# Altium schematic sheet Arduino_extension_connectors.SchDoc: Arduino & Morpho extension connectors
size A4; Date: Not used; ApprovedBy: Not used; CheckedBy: Not used; Author: Not used; CompanyName: STMicroelectronics; DrawnBy: Not used; Engineer: Not used; Organization: Not used; Address1: Not used; Address2: Not used; Address3: Not used; Address4: Not used; DocumentNumber: 6; Revision: Not used; SheetNumber: 6; SheetTotal: 8; CurrentTime: Not used; CurrentDate: Not used; Time: Not used; DocumentFullPathAndName: Not used; DocumentName: Not used; ModifiedDate: Not used; ImagePath: Not used; ProjectName: Not used; Application_BuildNumber: Not used
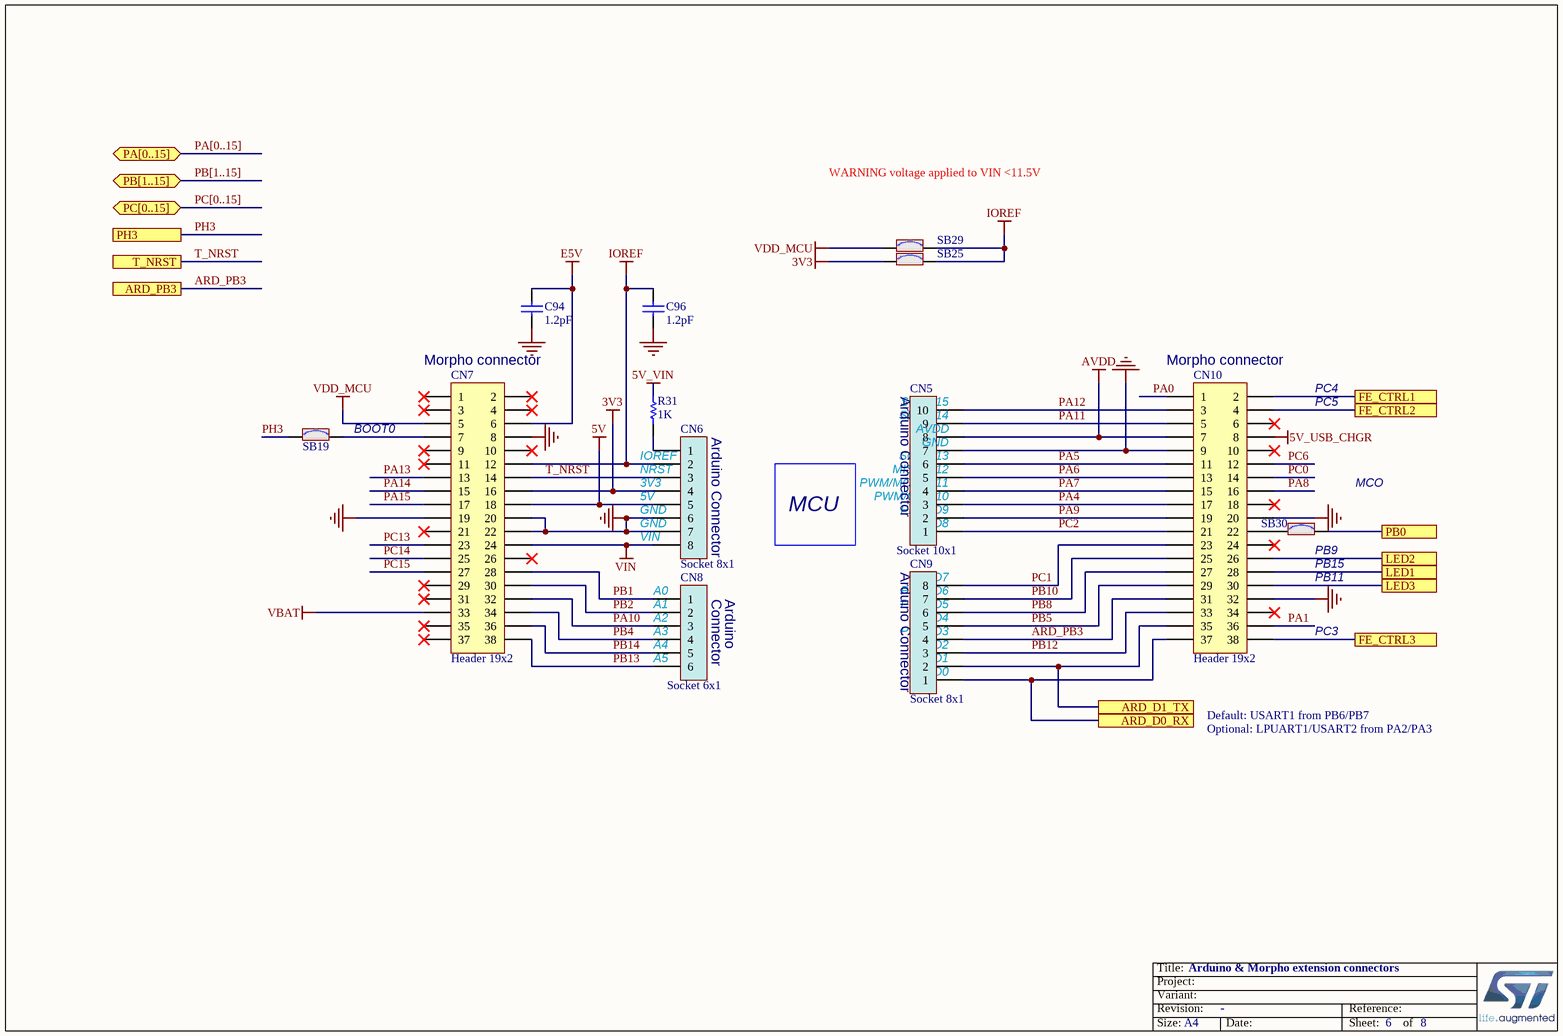
[diagram p0: Arduino_extension_connectors.SchDoc]

## Parts
C94  value 1.2pF  [C0402]  (hidden comment: Capacitor)
C96  value 1.2pF  [C0402]  (hidden comment: Capacitor)
CN5  value Socket 10x1  [CON_SAMTEC_SSW-110-03-X-S]
CN6  value Socket 8x1  [CON_SAMTEC_SSW-108-03-X-S]
CN7  value Header 19x2  [CON_SAMTEC_TSW-119-09-X-D]
CN8  value Socket 6x1  [CON_SAMTEC_SSW-106-03-X-S]
CN9  value Socket 8x1  [CON_SAMTEC_SSW-108-03-X-S]
CN10  value Header 19x2  [CON_SAMTEC_TSW-119-09-X-D]
R31  value 1K  [R0603]
SB19  (no value)  [SOLDER-BRIDGE_R0603-0R]
SB25  (no value)  [SOLDER-BRIDGE_R0603-0R]
SB29  (no value)  [SOLDER-BRIDGE_R0603-0R]
SB30  (no value)  [SOLDER-BRIDGE_R0603-0R]

## Ports
ARD_D0_RX, ARD_D1_TX, ARD_PB3, FE_CTRL1, FE_CTRL2, FE_CTRL3, LED1, LED2, LED3, PA[0..15] (bidir), PB0, PB[1..15] (bidir), PC[0..15] (bidir), PH3, T_NRST

## Nets
3V3: CN6.4 CN7.16 SB25.1
5V: CN6.5 CN7.18
5V_USB_CHGR: CN10.8
5V_VIN: R31.2
AVDD: CN5.8 CN10.7
E5V: C94.2 CN7.6
GND: C94.1 C96.1 CN5.7 CN6.6 CN6.7 CN7.8 CN7.19 CN7.20 CN7.22 CN10.9 CN10.20 CN10.32
IOREF: C96.2 CN6.2 CN7.12 SB25.2 SB29.2
VBAT: CN7.33
VDD_MCU: CN7.5 SB29.1
VIN: CN6.8 CN7.24
ARD_D0_RX: CN9.1 CN10.37 ; port ARD_D0_RX
ARD_D1_TX: CN9.2 CN10.35 ; port ARD_D1_TX
ARD_PB3: CN9.4 CN10.31 ; port ARD_PB3
FE_CTRL1: CN10.2 ; port FE_CTRL1
FE_CTRL2: CN10.4 ; port FE_CTRL2
FE_CTRL3: CN10.38 ; port FE_CTRL3
LED1: CN10.28 ; port LED1
LED2: CN10.26 ; port LED2
LED3: CN10.30 ; port LED3
PA0: CN10.1
PA1: CN10.36
PA4: CN5.3 CN10.17
PA5: CN5.6 CN10.11
PA6: CN5.5 CN10.13
PA7: CN5.4 CN10.15
PA8: CN10.16
PA9: CN5.2 CN10.19
PA10: CN7.32 CN8.3
PA11: CN5.9 CN10.5
PA12: CN5.10 CN10.3
PA13: CN7.13
PA14: CN7.15
PA15: CN7.17
PB0: SB30.2 ; port PB0
PB1: CN7.28 CN8.1
PB2: CN7.30 CN8.2
PB4: CN7.34 CN8.4
PB5: CN9.5 CN10.29
PB8: CN9.6 CN10.27
PB10: CN9.7 CN10.25
PB12: CN9.3 CN10.33
PB13: CN7.38 CN8.6
PB14: CN7.36 CN8.5
PC0: CN10.14
PC1: CN9.8 CN10.23
PC2: CN5.1 CN10.21
PC6: CN10.12
PC13: CN7.23
PC14: CN7.25
PC15: CN7.27
PH3: SB19.1 ; port PH3
T_NRST: CN6.3 CN7.14 ; port T_NRST
NetCN6_1: CN6.1 R31.1
NetCN7_7: CN7.7 SB19.2
NetCN10_22: CN10.22 SB30.1

Not connected (* = marked no-connect by the designer): CN7 1* 2* 3* 4* 9* 10* 11* 21* 26* 29* 31* 35* 37*; CN10 6* 10* 18* 24* 34*

## Buses and harness runs
bus PA[0..15] = port PA[0..15]
bus PB[1..15] = port PB[1..15]
bus PC[0..15] = port PC[0..15]

## Notes on the sheet
- WARNING voltage applied to VIN <11.5V
- Morpho connector
- (near CN10) Morpho connector
- (near CN7) BOOT0
- (near CN6) Arduino Connector
- (near CN5) Arduino Connector
- (near CN5) SDA/D14
- (near CN5) SCL/D15
- (near CN5) AVDD
- (near CN5) GND
- (near CN10) PC4
- (near CN10) PC5
- (near CN6) GND
- (near CN6) 5V
- (near CN6) 3V3
- (near CN6) NRST
- (near CN6) IOREF
- MCU
- (near CN5) PMW/D9
- (near CN5) PWM/CS/D10
- (near CN5) SCK/D13
- (near CN5) MISO/D12
- (near CN5) PWM/MOSI/D11
- (near SB30) MCO
- (near CN6) VIN
- (near CN9) Arduino Connector
- (near CN9) D7
- (near CN5) D8
- (near SB30) PB9
- PB15
- PB11
- (near CN8) A0
- (near CN8) A1
- (near CN8) A2
- (near CN8) A3
- (near CN8) A4
- (near CN8) Connector
- (near CN8) Arduino
- (near CN9) D2
- (near CN9) D4
- (near CN9) PWM/D3
- (near CN9) PWM/D5
- (near CN9) PWM/D6
- (near CN10) PC3
- (near CN8) A5
- (near CN9) RX/D0
- (near CN9) TX/D1
- Default: USART1 from PB6/PB7
  Optional: LPUART1/USART2 from PA2/PA3
- Title:
- Project:
- Size:
- Revision:
- Variant:
- -
- Date:
- Reference:
- Sheet:
- of

## Library data of the parts
C94 C96 = MCD-02065: Capacitor, High Q type for high frequency and high power, SMD, 1.2pF, 50V, 0,05pf, 0402; Part_Preference: Recommended; Manufacturer: MURATA; Manufacturer_Part_Number: GJM1555C1H1R2WB01D; Order_Code_RS: 846-7246; Internal_Part_Number: MCD-02065; BMS_Part_Number: N/A; Status: Checked; Part_Type: Capacitor; Alternate_Manufacturer: N/A; Alternate_Manufacturer_Part_Number: N/A; Package: C0402; ComponentLink1Description: Datasheet; ComponentLink1URL: http://tunmcdsvn.tun.st.com/Component_Datasheet_Library/Trunk/Capacitors/MURATA_Chip_Monolithic_Ceramic_Capacitors; Order_Code_Digikey: 490-11195-2-ND; Order_Code_Farnell: 2781428
CN5 = MCD-00262: Socket, 10x1, 2.54mm, VR, TH, Height 8.51mm/10mm; Manufacturer_Part_Number: SSW-110-03-x-S; Manufacturer: SAMTEC; Part_Type: Connector; Provided_By: SUBCO; Internal_Part_Number: MCD-00262; ComponentLink1Description: Datasheet; Status: Released; ComponentLink1URL: http://tunmcdsvn.tun.st.com/Component_Datasheet_Library/Trunk/Connectors/Samtec_SSW-SSQ-series; ECCN_US: n/a; ECCN_EU: n/a
CN6 CN9 = MCD-00261: Socket, 8x1, 2.54mm, VR, TH, Height 8.51mm/10mm; Manufacturer_Part_Number: SSW-108-03-x-S; Manufacturer: SAMTEC; Part_Type: Connector; Provided_By: SUBCO; Internal_Part_Number: MCD-00261; ComponentLink1Description: Datasheet; Status: Released; ComponentLink1URL: http://tunmcdsvn.tun.st.com/Component_Datasheet_Library/Trunk/Connectors/Samtec_SSW-SSQ-series; ECCN_US: n/a; ECCN_EU: n/a
CN7 CN10 = MCD-00213: Header, 19x2, 2,54mm, VR, TH, Height 5.84mm/10.16mm; Manufacturer_Part_Number: TSW-119-09-x-D; Manufacturer: SAMTEC; Part_Type: Connector; Provided_By: SUBCO; Internal_Part_Number: MCD-00213; ComponentLink1Description: Datasheet; Status: Released; ComponentLink1URL: http://tunmcdsvn.tun.st.com/Component_Datasheet_Library/Trunk/Connectors/Samtec_TSW-HTSW-series; ECCN_US: n/a; ECCN_EU: n/a
CN8 = MCD-00260: Socket, 6x1, 2.54mm, VR, TH, Height 8.51mm/10mm; Manufacturer_Part_Number: SSW-106-03-x-S; Manufacturer: SAMTEC; Part_Type: Connector; Provided_By: SUBCO; Internal_Part_Number: MCD-00260; ComponentLink1Description: Datasheet; Status: Released; ComponentLink1URL: http://tunmcdsvn.tun.st.com/Component_Datasheet_Library/Trunk/Connectors/Samtec_SSW-SSQ-series; ECCN_US: n/a; ECCN_EU: n/a
R31 = MCD-00070: Resistor,1K,0603,1%,1/10W; Manufacturer_Part_Number: RC0603FR-071KL; Manufacturer: YAGEO; Provided_By: SUBCO; ECCN_US: EAR99; ECCN_EU: NEC; Internal_Part_Number: MCD-00070; ComponentLink1Description: Datasheet; Status: Released; Part_Type: Resistor; Package: R0603; ComponentLink1URL: http://tunmcdsvn.tun.st.com/Component_Datasheet_Library/Trunk/Resistors/Yageo_Resistor_RC0603-series
SB19 SB25 SB29 SB30 = MCD-00071: Solder Bridge ON; Part_Type: Mechanical; Manufacturer_Part_Number: RC0603JR-070RL; Manufacturer: YAGEO; Provided_By: SUBCO; Internal_Part_Number: MCD-00071; Status: Released; Package: SB0603; ComponentLink1Description: Datasheet; ComponentLink1URL: http://tunmcdsvn.tun.st.com/Component_Datasheet_Library/Trunk/Resistors/Yageo_Resistor_RC0603-series; ECCN_US: n/a; ECCN_EU: n/a